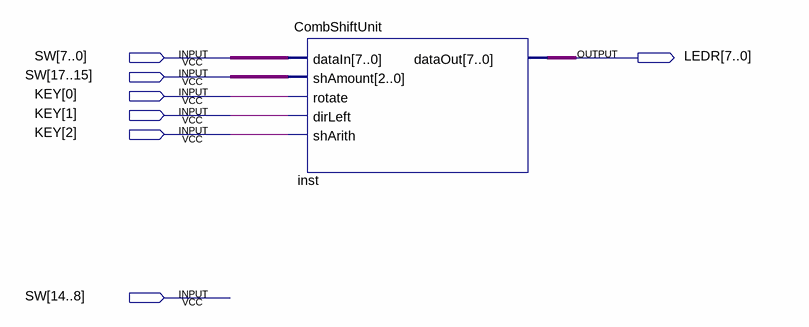
[diagram p0: schematic sheet]
// Quartus schematic CombShiftUnit_Demo.bdf as structural Verilog: 1 symbols, 7 pins
module CombShiftUnit_Demo (
  input  [17:0] SW,
  input  [2:0] KEY,
  output [7:0] LEDR
);

  CombShiftUnit inst (
    .dataIn(SW[7:0]), .shAmount(SW[17:15]), .rotate(KEY[0]), .dirLeft(KEY[1]), .shArith(KEY[2]),
    .dataOut(LEDR));
endmodule
